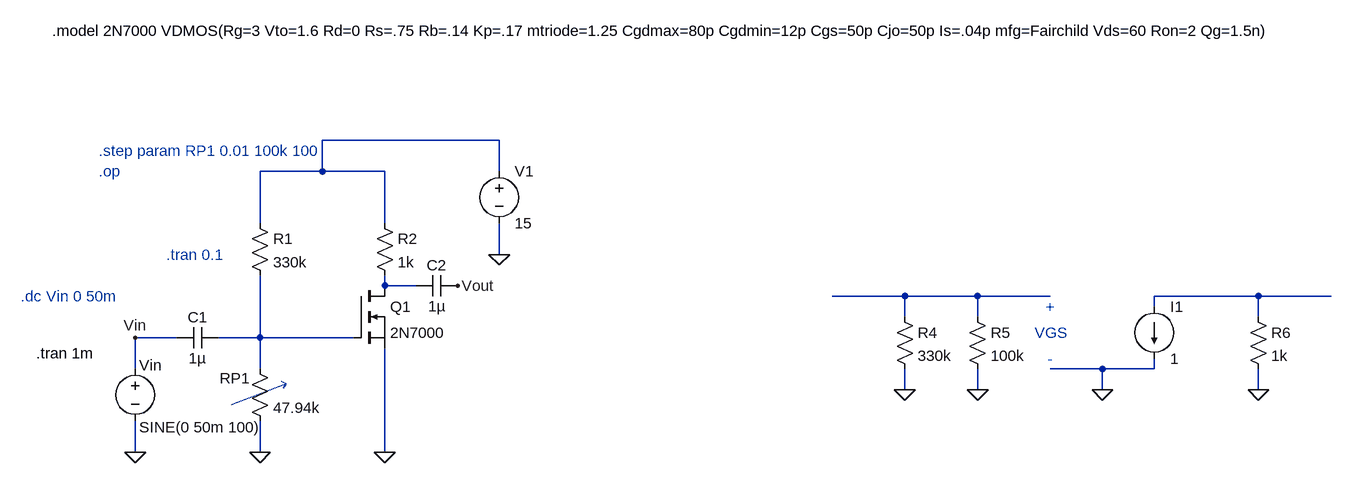
[diagram p0: schematic pre6.asc]
pre6.asc, the LTspice schematic file:
Version 4.1
SHEET 1 1796 724
WIRE 448 160 176 160
WIRE 176 208 176 160
WIRE 176 208 80 208
WIRE 272 208 176 208
WIRE 448 208 448 160
WIRE 80 288 80 208
WIRE 272 288 272 208
WIRE 448 336 448 288
WIRE 272 384 272 368
WIRE 320 384 272 384
WIRE 1072 400 960 400
WIRE 1184 400 1072 400
WIRE 1296 400 1184 400
WIRE 1616 400 1456 400
WIRE 1728 400 1616 400
WIRE 1456 416 1456 400
WIRE 1072 432 1072 400
WIRE 1184 432 1184 400
WIRE 1616 432 1616 400
WIRE -48 464 -112 464
WIRE 80 464 80 368
WIRE 80 464 16 464
WIRE 224 464 80 464
WIRE -112 512 -112 464
WIRE 80 512 80 464
WIRE 1376 512 1296 512
WIRE 1456 512 1456 496
WIRE 1456 512 1376 512
WIRE 1072 544 1072 512
WIRE 1184 544 1184 512
WIRE 1376 544 1376 512
WIRE 1616 544 1616 512
WIRE -112 640 -112 592
WIRE 80 640 80 592
WIRE 272 640 272 480
FLAG 448 336 0
FLAG 272 640 0
FLAG 80 640 0
FLAG 1184 544 0
FLAG 1072 544 0
FLAG 1376 544 0
FLAG 1616 544 0
FLAG 384 384 Vout
FLAG -112 640 0
FLAG -112 464 Vin
SYMBOL voltage 448 192 R0
SYMATTR InstName V1
SYMATTR Value 15
SYMBOL res 64 272 R0
SYMATTR InstName R1
SYMATTR Value 330k
SYMBOL res 256 272 R0
SYMATTR InstName R2
SYMATTR Value 1k
SYMBOL nmos 224 384 R0
SYMATTR InstName Q1
SYMATTR Value 2N7000
SYMBOL res 64 496 R0
WINDOW 0 -46 30 Left 2
SYMATTR InstName RP1
SYMATTR Value 47.94k
SYMBOL res 1056 416 R0
SYMATTR InstName R4
SYMATTR Value 330k
SYMBOL res 1168 416 R0
SYMATTR InstName R5
SYMATTR Value 100k
SYMBOL current 1456 416 R0
WINDOW 123 0 0 Left 0
WINDOW 39 0 0 Left 0
SYMATTR InstName I1
SYMATTR Value 1
SYMBOL res 1600 416 R0
SYMATTR InstName R6
SYMATTR Value 1k
SYMBOL cap 384 368 R90
WINDOW 0 0 32 VBottom 2
WINDOW 3 32 32 VTop 2
SYMATTR InstName C2
SYMATTR Value 1µ
SYMBOL cap 16 448 R90
WINDOW 0 0 32 VBottom 2
WINDOW 3 32 32 VTop 2
SYMATTR InstName C1
SYMATTR Value 1µ
SYMBOL voltage -112 496 R0
WINDOW 0 6 10 Left 2
WINDOW 3 6 106 Left 2
WINDOW 123 0 0 Left 0
WINDOW 39 0 0 Left 0
SYMATTR InstName Vin
SYMATTR Value SINE(0 50m 100)
TEXT -240 -8 Left 2 !.model 2N7000 VDMOS(Rg=3 Vto=1.6 Rd=0 Rs=.75 Rb=.14 Kp=.17 mtriode=1.25 Cgdmax=80p Cgdmin=12p Cgs=50p Cjo=50p Is=.04p mfg=Fairchild Vds=60 Ron=2 Qg=1.5n)
TEXT 1296 416 Center 2 ;+
TEXT 1296 496 Center 2 ;-
TEXT 1272 456 Left 2 ;VGS
TEXT -64 336 Left 2 ;.tran 0.1
TEXT -168 176 Left 2 ;.step param RP1 0.01 100k 100
TEXT -168 208 Left 2 ;.op
TEXT -264 488 Left 2 !.tran 1m
TEXT -288 400 Left 2 ;.dc Vin 0 50m
LINE Normal 120 535 36 567
LINE Normal 116 542 120 535
LINE Normal 113 531 120 535

The netlist it stands for:
* pre6.asc
V1 N001 0 15
R1 N001 N005 330k
R2 N001 N002 1k
M§Q1 N002 N005 0 0 2N7000
RP1 N005 0 47.94k
R4 N003 0 330k
R5 N003 0 100k
I1 N004 0 1
R6 N004 0 1k
C2 Vout N002 1µ
C1 N005 Vin 1µ
Vin Vin 0 SINE(0 50m 100)
.model NMOS NMOS
.model PMOS PMOS
.lib standard.mos
.model 2N7000 VDMOS(Rg=3 Vto=1.6 Rd=0 Rs=.75 Rb=.14 Kp=.17 mtriode=1.25 Cgdmax=80p Cgdmin=12p Cgs=50p Cjo=50p Is=.04p mfg=Fairchild Vds=60 Ron=2 Qg=1.5n)
* +
* -
* VGS
* .tran 0.1
* .step param RP1 0.01 100k 100
* .op
.tran 1m
* .dc Vin 0 50m
.backanno
.end